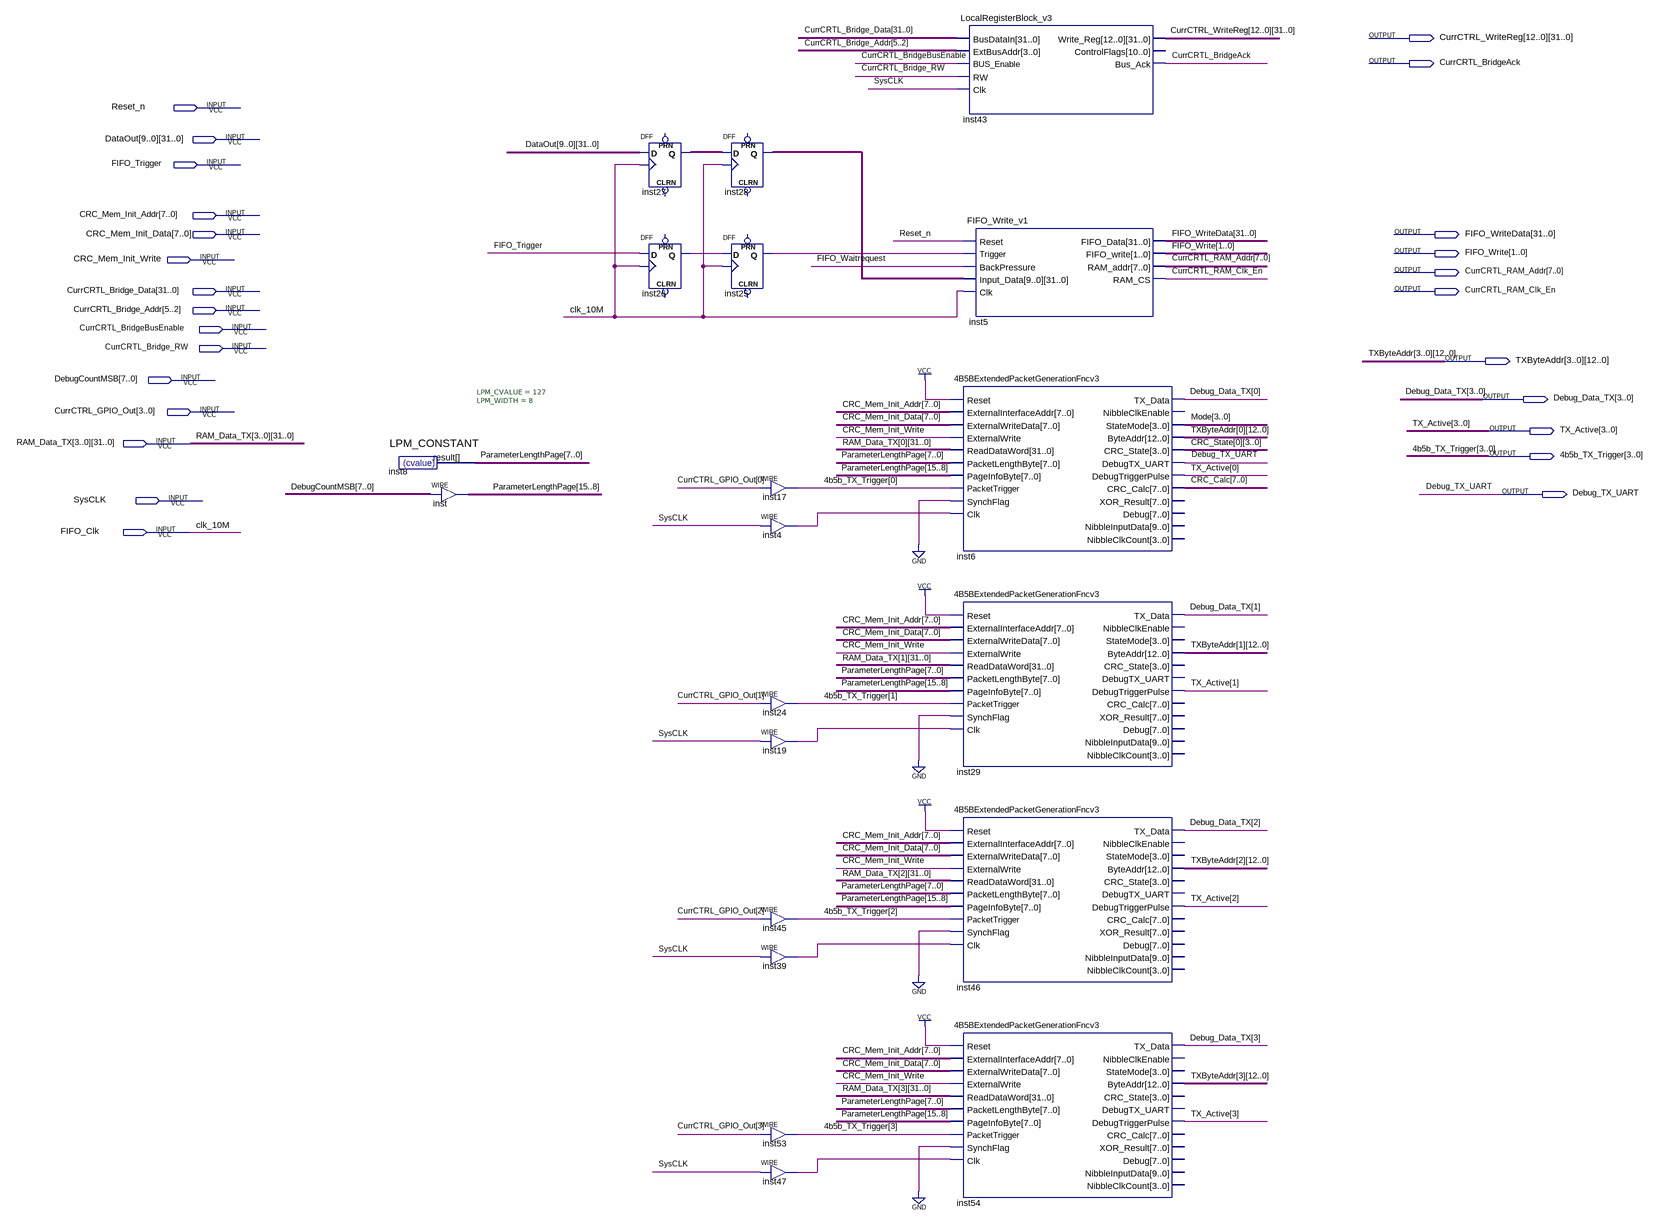
[diagram p0: schematic sheet]
// Quartus schematic CurrCTRL_CPU_Interface.bdf as structural Verilog: 20 symbols, 26 pins
module CurrCTRL_CPU_Interface (
  input  Reset_n,
  input  [31:0] DataOut_9,
  input  [31:0] DataOut_8,
  input  [31:0] DataOut_7,
  input  [31:0] DataOut_6,
  input  [31:0] DataOut_5,
  input  [31:0] DataOut_4,
  input  [31:0] DataOut_3,
  input  [31:0] DataOut_2,
  input  [31:0] DataOut_1,
  input  [31:0] DataOut_0,
  input  FIFO_Trigger,
  input  [7:0] CRC_Mem_Init_Addr,
  input  [7:0] CRC_Mem_Init_Data,
  input  CRC_Mem_Init_Write,
  input  [31:0] CurrCRTL_Bridge_Data,
  input  [5:2] CurrCRTL_Bridge_Addr,
  input  CurrCRTL_BridgeBusEnable,
  input  CurrCRTL_Bridge_RW,
  input  [7:0] DebugCountMSB,
  input  [3:0] CurrCTRL_GPIO_Out,
  input  [31:0] RAM_Data_TX_3,
  input  [31:0] RAM_Data_TX_2,
  input  [31:0] RAM_Data_TX_1,
  input  [31:0] RAM_Data_TX_0,
  input  SysCLK,
  input  FIFO_Clk,
  output [31:0] CurrCTRL_WriteReg_12,
  output [31:0] CurrCTRL_WriteReg_11,
  output [31:0] CurrCTRL_WriteReg_10,
  output [31:0] CurrCTRL_WriteReg_9,
  output [31:0] CurrCTRL_WriteReg_8,
  output [31:0] CurrCTRL_WriteReg_7,
  output [31:0] CurrCTRL_WriteReg_6,
  output [31:0] CurrCTRL_WriteReg_5,
  output [31:0] CurrCTRL_WriteReg_4,
  output [31:0] CurrCTRL_WriteReg_3,
  output [31:0] CurrCTRL_WriteReg_2,
  output [31:0] CurrCTRL_WriteReg_1,
  output [31:0] CurrCTRL_WriteReg_0,
  output CurrCRTL_BridgeAck,
  output [31:0] FIFO_WriteData,
  output [1:0] FIFO_Write,
  output [7:0] CurrCRTL_RAM_Addr,
  output CurrCRTL_RAM_Clk_En,
  output [12:0] TXByteAddr_3,
  output [12:0] TXByteAddr_2,
  output [12:0] TXByteAddr_1,
  output [12:0] TXByteAddr_0,
  output [3:0] Debug_Data_TX,
  output [3:0] TX_Active,
  output [3:0] \4b5b_TX_Trigger ,
  output Debug_TX_UART
);

  wire FIFO_Waitrequest, inst4_out, inst19_out, inst25_q, inst26_q, inst39_out, inst47_out;
  wire [3:0] CRC_State_0, Mode;
  wire [7:0] CRC_Calc;
  wire [15:0] ParameterLengthPage;
  wire [319:0] inst27_q, inst28_q;

  LPM_CONSTANT #(.LPM_CVALUE(127), .LPM_WIDTH(8)) inst8 (.result(ParameterLengthPage[7:0]));
  assign ParameterLengthPage[15:8] = DebugCountMSB;  // WIRE inst
  DFF inst27[319:0] (
    .CLK(FIFO_Clk),
    .D({DataOut_9, DataOut_8, DataOut_7, DataOut_6, DataOut_5, DataOut_4, DataOut_3, DataOut_2, DataOut_1, DataOut_0}),
    .Q(inst27_q));  // open: CLRN, PRN
  DFF inst26 (.CLK(FIFO_Clk), .D(FIFO_Trigger), .Q(inst26_q));  // open: CLRN, PRN
  DFF inst28[319:0] (.CLK(FIFO_Clk), .D(inst27_q), .Q(inst28_q));  // open: CLRN, PRN
  DFF inst25 (.CLK(FIFO_Clk), .D(inst26_q), .Q(inst25_q));  // open: CLRN, PRN
  assign \4b5b_TX_Trigger [0] = CurrCTRL_GPIO_Out[0];  // WIRE inst17
  assign inst4_out = SysCLK;  // WIRE inst4
  assign \4b5b_TX_Trigger [1] = CurrCTRL_GPIO_Out[1];  // WIRE inst24
  assign inst19_out = SysCLK;  // WIRE inst19
  assign \4b5b_TX_Trigger [2] = CurrCTRL_GPIO_Out[2];  // WIRE inst45
  assign inst39_out = SysCLK;  // WIRE inst39
  assign \4b5b_TX_Trigger [3] = CurrCTRL_GPIO_Out[3];  // WIRE inst53
  assign inst47_out = SysCLK;  // WIRE inst47
  LocalRegisterBlock_v3 inst43 (
    .BusDataIn(CurrCRTL_Bridge_Data), .ExtBusAddr(CurrCRTL_Bridge_Addr),
    .BUS_Enable(CurrCRTL_BridgeBusEnable), .RW(CurrCRTL_Bridge_RW), .Clk(SysCLK),
    .Write_Reg({CurrCTRL_WriteReg_12, CurrCTRL_WriteReg_11, CurrCTRL_WriteReg_10, CurrCTRL_WriteReg_9, CurrCTRL_WriteReg_8, CurrCTRL_WriteReg_7, CurrCTRL_WriteReg_6, CurrCTRL_WriteReg_5, CurrCTRL_WriteReg_4, CurrCTRL_WriteReg_3, CurrCTRL_WriteReg_2, CurrCTRL_WriteReg_1, CurrCTRL_WriteReg_0}),
    .Bus_Ack(CurrCRTL_BridgeAck));  // open: ControlFlags
  FIFO_Write_v1 inst5 (
    .Reset(Reset_n), .Trigger(inst25_q), .BackPressure(FIFO_Waitrequest), .Input_Data(inst28_q),
    .Clk(FIFO_Clk), .FIFO_Data(FIFO_WriteData), .FIFO_write(FIFO_Write), .RAM_addr(CurrCRTL_RAM_Addr),
    .RAM_CS(CurrCRTL_RAM_Clk_En));
  \4B5BExtendedPacketGenerationFncv3  inst6 (
    .Reset(1'b1), .ExternalInterfaceAddr(CRC_Mem_Init_Addr), .ExternalWriteData(CRC_Mem_Init_Data),
    .ExternalWrite(CRC_Mem_Init_Write), .ReadDataWord(RAM_Data_TX_0),
    .PacketLengthByte(ParameterLengthPage[7:0]), .PageInfoByte(ParameterLengthPage[15:8]),
    .PacketTrigger(\4b5b_TX_Trigger [0]), .SynchFlag(1'b0), .Clk(inst4_out), .TX_Data(Debug_Data_TX[0]),
    .StateMode(Mode), .ByteAddr(TXByteAddr_0), .CRC_State(CRC_State_0), .DebugTX_UART(Debug_TX_UART),
    .DebugTriggerPulse(TX_Active[0]), .CRC_Calc(CRC_Calc));  // open: NibbleClkEnable, XOR_Result, Debug, NibbleInputData, NibbleClkCount
  \4B5BExtendedPacketGenerationFncv3  inst29 (
    .Reset(1'b1), .ExternalInterfaceAddr(CRC_Mem_Init_Addr), .ExternalWriteData(CRC_Mem_Init_Data),
    .ExternalWrite(CRC_Mem_Init_Write), .ReadDataWord(RAM_Data_TX_1),
    .PacketLengthByte(ParameterLengthPage[7:0]), .PageInfoByte(ParameterLengthPage[15:8]),
    .PacketTrigger(\4b5b_TX_Trigger [1]), .SynchFlag(1'b0), .Clk(inst19_out), .TX_Data(Debug_Data_TX[1]),
    .ByteAddr(TXByteAddr_1), .DebugTriggerPulse(TX_Active[1]));  // open: NibbleClkEnable, StateMode, CRC_State, DebugTX_UART, CRC_Calc, XOR_Result, Debug, NibbleInputData, NibbleClkCount
  \4B5BExtendedPacketGenerationFncv3  inst46 (
    .Reset(1'b1), .ExternalInterfaceAddr(CRC_Mem_Init_Addr), .ExternalWriteData(CRC_Mem_Init_Data),
    .ExternalWrite(CRC_Mem_Init_Write), .ReadDataWord(RAM_Data_TX_2),
    .PacketLengthByte(ParameterLengthPage[7:0]), .PageInfoByte(ParameterLengthPage[15:8]),
    .PacketTrigger(\4b5b_TX_Trigger [2]), .SynchFlag(1'b0), .Clk(inst39_out), .TX_Data(Debug_Data_TX[2]),
    .ByteAddr(TXByteAddr_2), .DebugTriggerPulse(TX_Active[2]));  // open: NibbleClkEnable, StateMode, CRC_State, DebugTX_UART, CRC_Calc, XOR_Result, Debug, NibbleInputData, NibbleClkCount
  \4B5BExtendedPacketGenerationFncv3  inst54 (
    .Reset(1'b1), .ExternalInterfaceAddr(CRC_Mem_Init_Addr), .ExternalWriteData(CRC_Mem_Init_Data),
    .ExternalWrite(CRC_Mem_Init_Write), .ReadDataWord(RAM_Data_TX_3),
    .PacketLengthByte(ParameterLengthPage[7:0]), .PageInfoByte(ParameterLengthPage[15:8]),
    .PacketTrigger(\4b5b_TX_Trigger [3]), .SynchFlag(1'b0), .Clk(inst47_out), .TX_Data(Debug_Data_TX[3]),
    .ByteAddr(TXByteAddr_3), .DebugTriggerPulse(TX_Active[3]));  // open: NibbleClkEnable, StateMode, CRC_State, DebugTX_UART, CRC_Calc, XOR_Result, Debug, NibbleInputData, NibbleClkCount

  // Other names for the same wires on the sheet: clk_10M = FIFO_Clk
endmodule
